# Altium schematic sheet 测试项说明.SchDoc
size A4
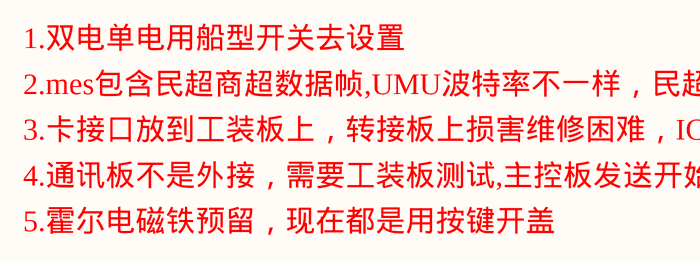
[diagram p0: 测试项说明.SchDoc]

## Notes on the sheet
- 1.双电单电用船型开关去设置
- 2.mes包含民超商超数据帧,UMU波特率不一样，民超2400 商超38400
- 3.卡接口放到工装板上，转接板上损害维修困难，IC卡直插和NFC不做兼容
- 4.通讯板不是外接，需要工装板测试,主控板发送开始上告，工装板返回OK
- 5.霍尔电磁铁预留，现在都是用按键开盖